# EAGLE design Caricabatterie (EAGLE 4.16)
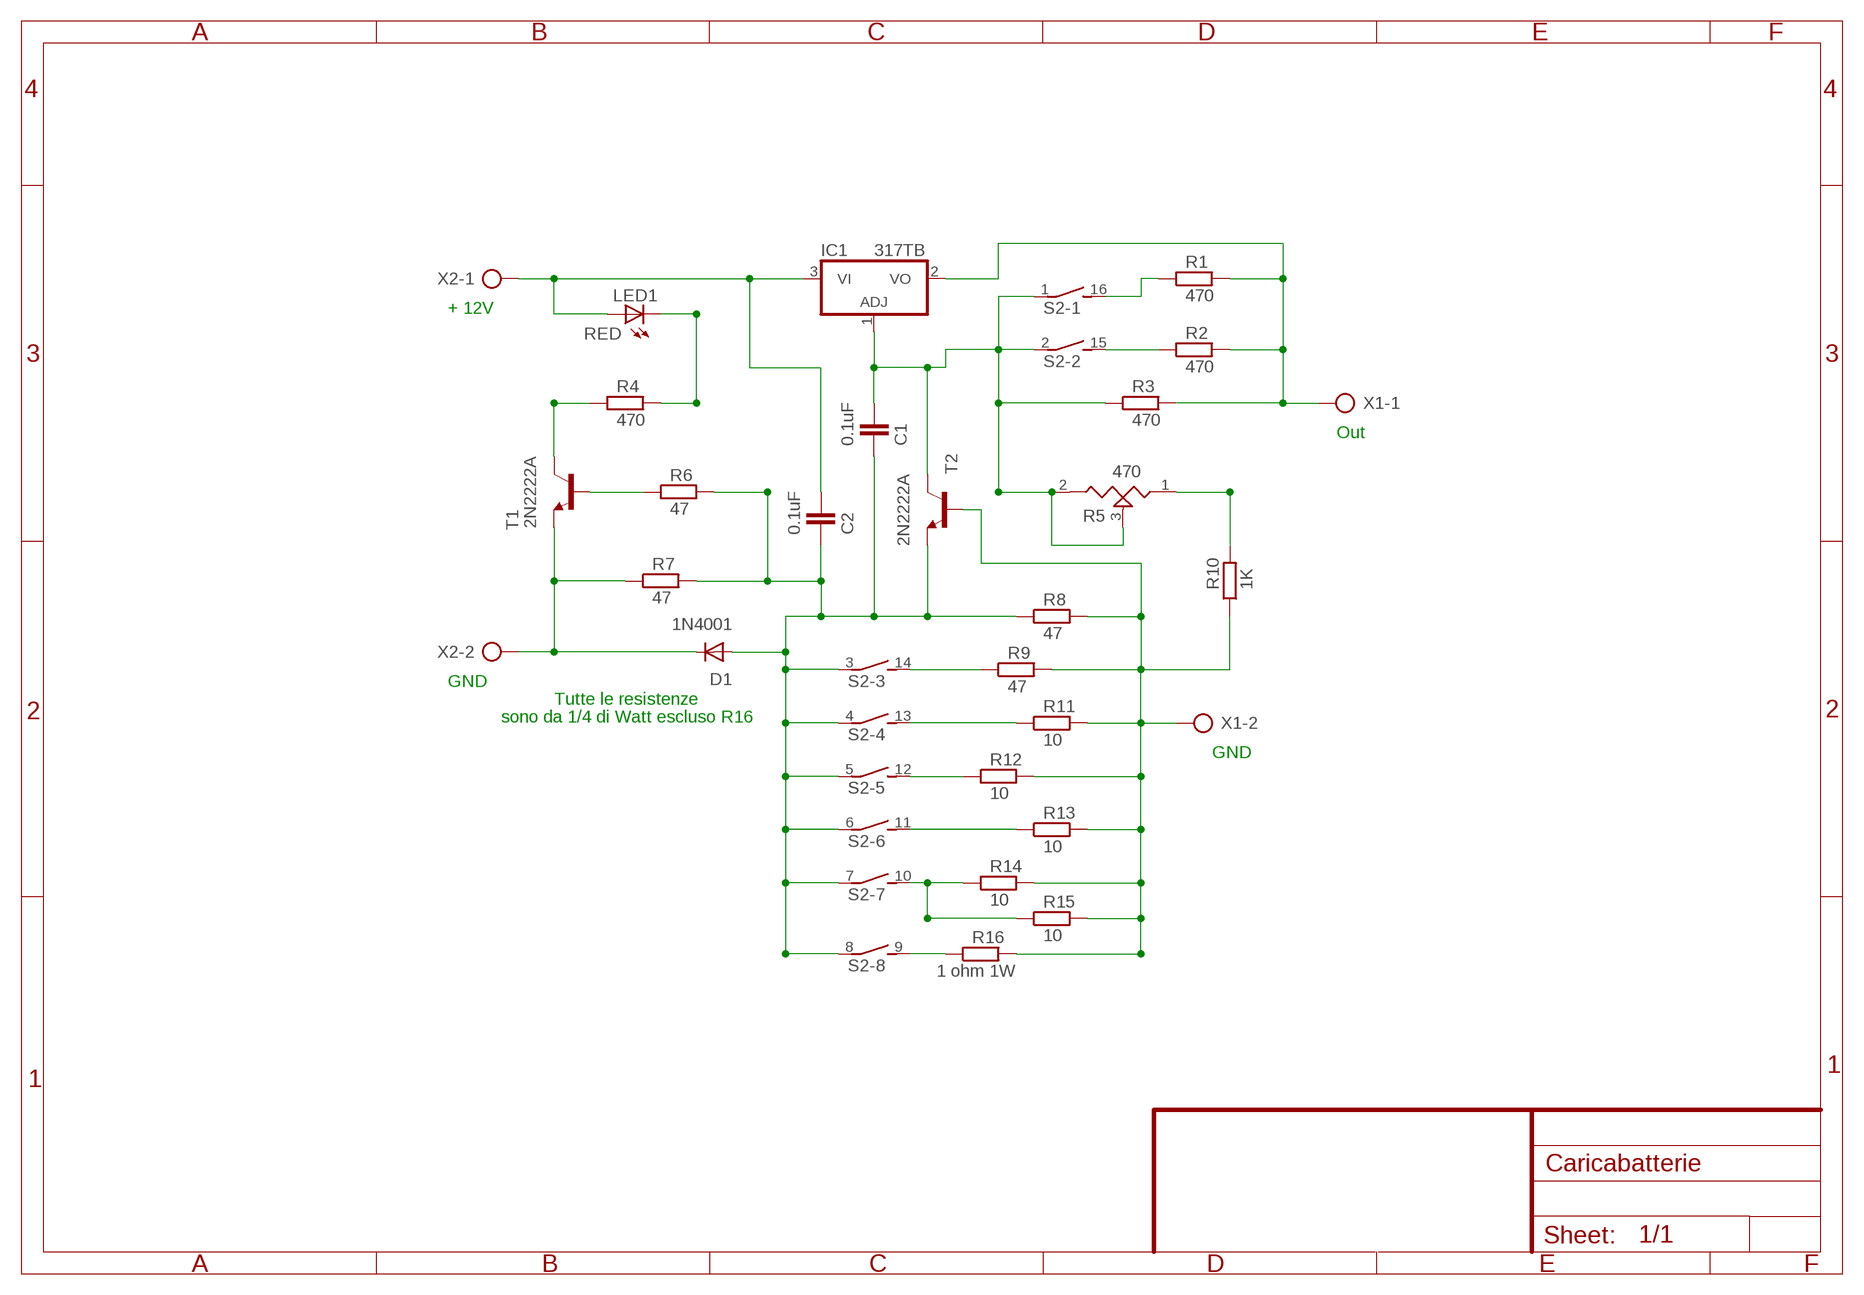
[diagram p0: schematic, sheet 1]

## Parts
C1  0.1uF  C-EU050-025X075  [C050-025X075]
C2  0.1uF  C-EU050-025X075  [C050-025X075]
D1  1N4001  1N4004  [DO41-10]
IC1  317TB  317T  [TO220H]
LED1  RED  LED5MM  [LED5MM]
R1  470  R-EU_0207/10  [0207/10]
R2  470  R-EU_0207/10  [0207/10]
R3  470  R-EU_0207/10  [0207/10]
R4  470  R-EU_0207/10  [0207/10]
R5  470  POTUS-L  [PT-10]
R6  47  R-EU_0207/10  [0207/10]
R7  47  R-EU_0207/10  [0207/10]
R8  47  R-EU_0207/10  [0207/10]
R9  47  R-EU_0207/10  [0207/10]
R10  1K  R-EU_0207/10  [0207/10]
R11  10  R-EU_0207/10  [0207/10]
R12  10  R-EU_0207/10  [0207/10]
R13  10  R-EU_0207/10  [0207/10]
R14  10  R-EU_0207/10  [0207/10]
R15  10  R-EU_0207/10  [0207/10]
R16  1 ohm 1W  R-EU_0411/15  [0411/15]
S2  DS08E  [DS-08]
T1  2N2222A  2N2222  [TO18]
T2  2N2222A  2N2222  [TO18]
X1  AK300/2  [AK300/2]
X2  AK300/2  [AK300/2]

## Nets
N$1: R4.1 T1.3(C)
N$2: LED1.K(C) R4.2
N$3: IC1.2(VO) R1.2 R2.2 R3.2 X1.1
N$4: R6.1 T1.2(B)
N$5: R1.1 S2.16
N$6: C2.1 IC1.3(VI) LED1.A X2.1
N$7: R2.1 S2.15
N$8: D1.C R7.1 T1.1(E) X2.2
N$9: C1.2 C2.2 D1.A R6.2 R7.2 R8.1 S2.3 S2.4 S2.5 S2.6 S2.7 S2.8 T2.1(E)
N$10: R5.1 R10.2
N$11: C1.1 IC1.1(ADJ) R3.1 R5.2 R5.3 S2.1 S2.2 T2.3(C)
N$12: R9.1 S2.14
N$13: R8.2 R9.2 R10.1 R11.2 R12.2 R13.2 R14.2 R15.2 R16.2 T2.2(B) X1.2
N$14: R16.1 S2.9
N$15: R14.1 R15.1 S2.10
N$16: R13.1 S2.11
N$17: R12.1 S2.12
N$18: R11.1 S2.13

## Notes on the sheet
- + 12V
- Out
- GND
- Tutte le resistenze
- sono da 1/4 di Watt escluso R16
- GND

## Library data of the parts
C1 C2 = rcl:C-EU: CAPACITOR, European symbol
D1 = diode:1N4004: DIODE general purpose rectifier, 1 A
IC1 = linear:*317: Positive VOLTAGE REGULATOR
LED1 = led:LED: LED OSRAM: - CHIPLED LG R971, LG N971, LY N971, LG Q971, LY Q971, LO R971, LY R971 LH N974, LH R974 LS Q976, LO Q976, LY Q976 LO Q996 - Hyper CHIPLED LW Q18S LB Q993, LB Q99A, LB R99A - SideLED LS A670, LO A670, LY A670, LG A670, LP A670 LB A673, LV A673, LT A673, LW A673 LH A674 LY A675 LS A676, LA A676, LO A676, LY A676, LW A676 LS A679, LY A679, LG A679 - Hyper Micro SIDELED® LS Y876, LA Y876, LO Y876, LY Y876 LT Y87S - SmartLED LW L88C, LW L88S LB L89C, LB L89S, LG L890 LS L89K, LO L89K, LY L89K LS L896, LA L896, LO L896, LY L896 - TOPLED LS T670, LO T670, LY T670, LG T670, LP T670 LSG T670, LSP T670, LSY T670, LOP T670, LYG T670 LG T671, LOG T671, LSG T671 LB T673, LV T673, LT T673, LW T673 LH T674 LS T676, LA T676, LO T676, LY T676, LB T676, LH T676, LSB T676, LW T676 LB T67C, LV T67C, LT T67C, LS T67K, LO T67K, LY T67K, LW E67C LS E67B, LA E67B, LO E67B, LY E67B, LB E67C, LV E67C, LT E67C LW T67C LS T679, LY T679, LG T679 LS T770, LO T770, LY T770, LG T770, LP T770 LB T773, LV T773, LT T773, LW T773 LH T774 LS E675, LA E675, LY E675, LS T675 LS T776, LA T776, LO T776, LY T776, LB T776 LHGB T686 LT T68C, LB T68C - Hyper Mini TOPLED® LB M676 - Mini TOPLED Santana® LG M470 LS M47K, LO M47K, LY M47K Source: http://www.osram.convergy.de/
R1-R4 R6-R16 = rcl:R-EU_: RESISTOR, European symbol
R5 = discrete:POTUS-L
S2 = switch-dil:DS08E: DIL/CODE SWITCH
T1 T2 = transistor:2N2222: NPN TRANSISTOR
X1 X2 = con-ptr500:AK300/2: CONNECTOR

## Board
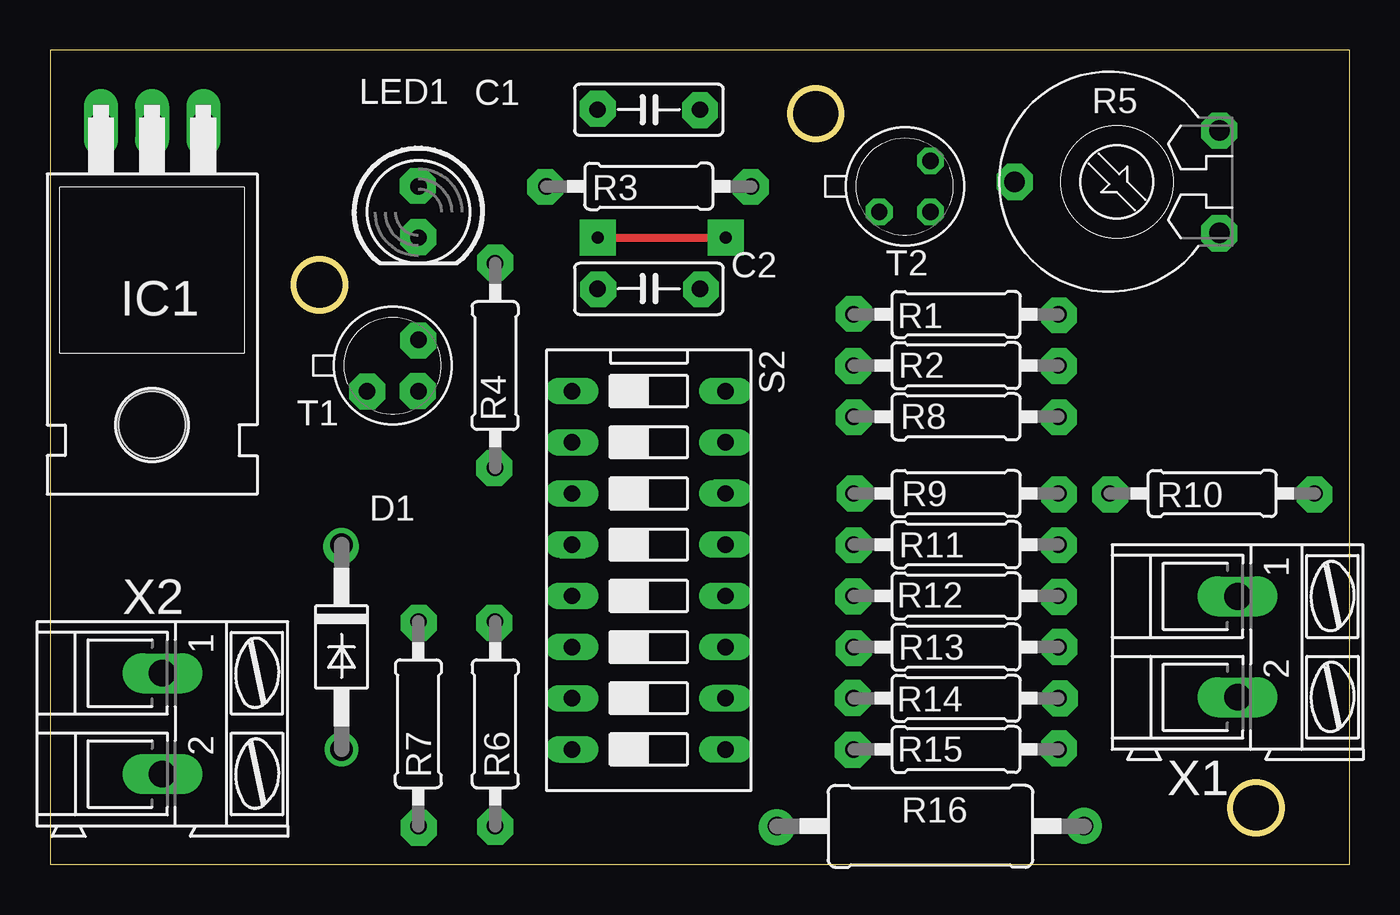
[diagram p1: board, top side]
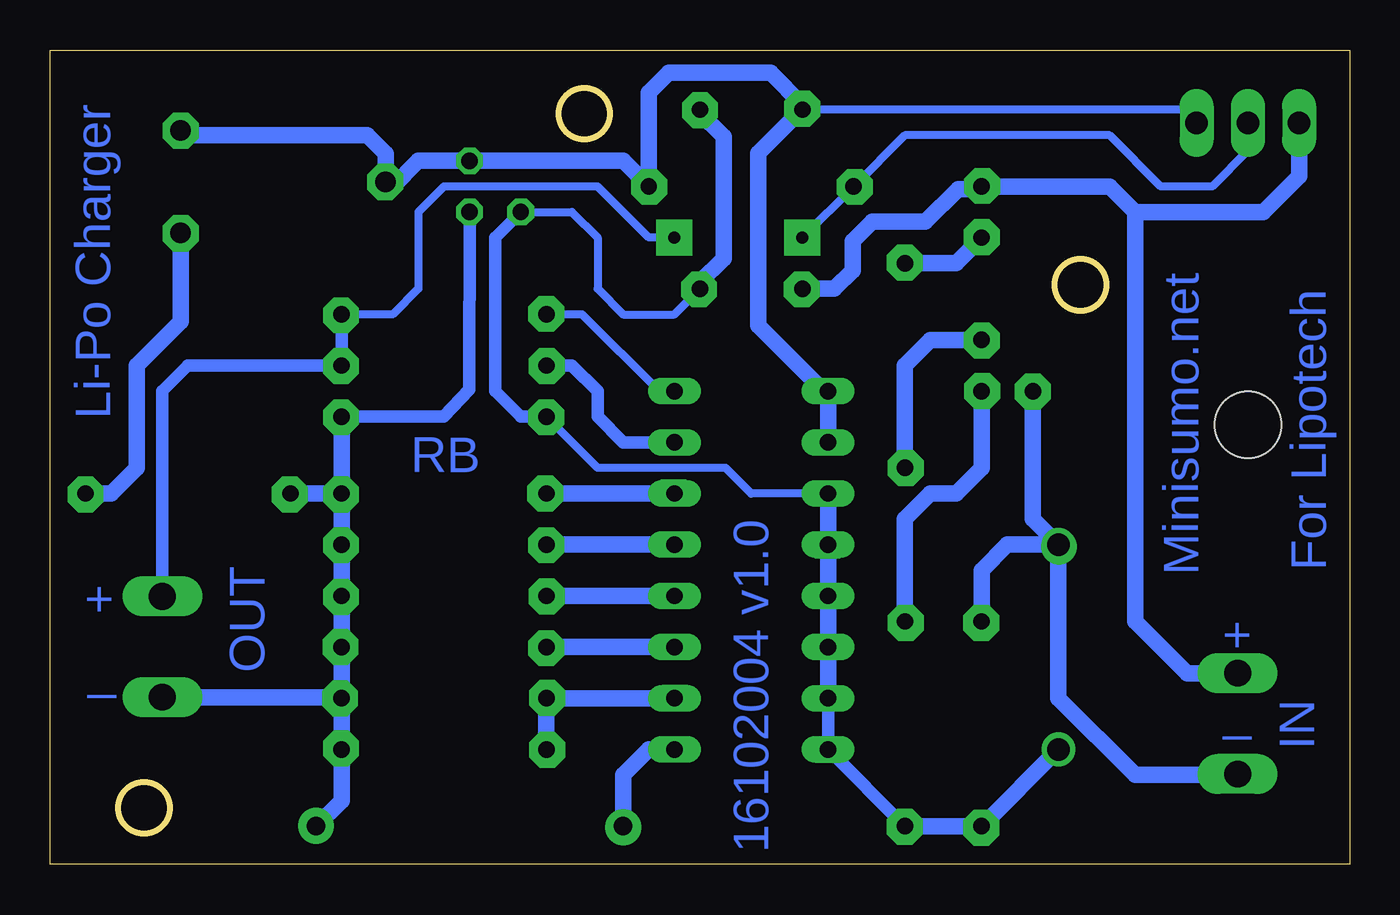
[diagram p2: board, bottom side, seen from below]

Size 64.44 x 40.4 mm. Coordinates in mm from the lower left corner, seen from the top.
Outline: 0,0 64.44,0 64.44,40.4 0,40.4 0,0
Outline: circle at 59.8,2.81 radius 1.27
Outline: circle at 13.35,28.77 radius 1.27
Outline: circle at 37.96,37.26 radius 1.27
Copper layers (1*16): Top 0.035mm / dielectric 1.5mm / Bottom 0.03mm
Design rules "default": minimum track width 10mil, minimum drill 0.0005mm, track to track 8mil, track to pad 8mil, pad to pad 8mil, via to via 8mil, smd to smd 8mil, copper to edge 40mil, drill to drill 8mil, minimum pad ring 10mil, minimum via ring 8mil, stop-mask expansion 4mil, vias tented up to drill 0mil, thermal gap 10mil

### Footprints (pad centres in the part's own frame; a part is rotated, then mirrored left to right if it is on the bottom)
C050-025X075 = drill 0.813 octagon: 1 -2.54,0; 2 2.54,0
DO41-10 = drill 1.118 round: A 5.08,0; C -5.08,0
TO220H = drill 1.118 long: 1 -2.54,-10.16; 2 0,-10.16; 3 2.54,-10.16 | hole 3.302: 0,4.826
LED5MM = drill 0.813 octagon: A -1.27,0; K 1.27,0
0207/10 = drill 0.813 octagon: 1 -5.08,0; 2 5.08,0
PT-10 = drill 1.016 pad 1.778 octagon: 1 -2.54,-5.08; 2 2.54,-5.08; 3 0,5.08
0411/15 = drill 0.914 octagon: 1 -7.62,0; 2 7.62,0
DS-08 = drill 0.813 long: 1 -8.89,-3.81; 2 -6.35,-3.81; 3 -3.81,-3.81; 4 -1.27,-3.81; 5 1.27,-3.81; 6 3.81,-3.81; 7 6.35,-3.81; 8 8.89,-3.81; 9 8.89,3.81; 10 6.35,3.81; 11 3.81,3.81; 12 1.27,3.81; 13 -1.27,3.81; 14 -3.81,3.81; 15 -6.35,3.81; 16 -8.89,3.81
TO18 = drill 0.813 octagon: 1 -1.27,-1.27; 2 1.27,-1.27; 3 1.27,1.27
AK300/2 = drill 1.321 long: 1 -2.515,0; 2 2.489,0

### Placement (x,y rotation side)
C1  29.68,37.46 0 top
C2  29.68,28.57 0 top
D1  14.44,10.79 270 top
IC1  5.04,26.64 180 top
LED1  18.25,32.38 270 top
R1  44.92,27.3 0 top
R2  44.92,24.76 0 top
R3  29.68,33.65 180 top
R4  22.06,24.76 90 top
R5  52.9,33.88 90 top
R6  22.06,6.98 270 top
R7  18.25,6.98 270 top
R8  44.92,22.22 0 top
R9  44.92,18.41 0 top
R10  57.62,18.41 0 top
R11  44.92,15.87 0 top
R12  44.92,13.33 0 top
R13  44.92,10.79 0 top
R14  44.92,8.25 0 top
R15  44.92,5.71 0 top
R16  43.65,1.9 0 top
S2  29.68,14.6 270 top
T1  16.98,24.76 0 top
T2  42.38,33.65 0 top
X1  58.89,10.79 270 top
X2  5.55,6.98 270 top

### Tracks (layer width: path | path; a pad name or v marks a point on that pad's centre or on a via)
N$1
  Bottom 0.813: R4.1 22.06,24.76 20.79,26.03 T1.3
N$2
  Bottom 0.813: R4.2 19.52,29.84 LED1.K
N$3  (via drill 0.6 pad 1.78)
  Top 0.406: v27.14,31.11 v33.49,31.11
  Bottom 0.406: v33.49,31.11 34.76,31.11 37.3,33.65 44.92,33.65 46.19,32.38 46.19,28.57 47.46,27.3 R1.2 | v27.14,31.11 R3.2 22.06,36.19 11.9,36.19 9.36,33.65 6.82,33.65 5.04,35.43 IC1.2
  Bottom 0.61: X1.1 58.89,23.49 57.62,24.76 R2.2 R1.2
N$4
  Bottom 0.813: R6.1 22.06,17.14 20.79,18.41 19.52,18.41 18.25,19.68 T1.2
N$5
  Bottom 0.406: S2.16 34.25,23.49 38.06,27.3 R1.1 39.87,27.32
N$6
  Bottom 0.813: 10.63,32.38 11.9,33.65 LED1.A 18.25,33.67 | 10.63,32.38 4.28,32.38 2.5,34.16 IC1.3 | X2.1 8.06,9.5 10.63,12.06 10.63,32.38 | C2.1 25.56,28.57 24.65,29.48 24.65,30.93 23.69,31.9 21.04,31.9 19.42,33.52 18.4,33.52 18.25,33.67 | 18.22,33.7 18.25,33.67
N$7
  Bottom 0.61: R2.1 38.57,24.76 37.3,23.49 37.3,22.22 36.03,20.95 S2.15
N$8  (via drill 0.5 pad 1.78)
  Bottom 0.406: v15.71,23.46 T1.1 | 5.55,4.44 X2.2
  Bottom 0.813: R7.1 18.25,14.6 16.98,15.87 D1.C | v15.71,23.46 15.71,17.14 D1.C | D1.C 14.44,8.25 10.63,4.44 5.55,4.44
N$9  (via drill 0.5 pad 1.78)
  Bottom 0.406: S2.3 29.68,18.41 30.95,19.68 37.3,19.68 R8.1 | T2.1 38.57,32.38 37.3,31.11 37.3,28.57 36.03,27.3 33.49,27.3 C2.2 | v32.22,37.44 C1.2
  Bottom 0.61: R8.1 41.11,22.22 42.38,23.49 42.38,31.11 T2.1 | S2.7 S2.8 R6.2
  Bottom 0.813: S2.7 S2.6 S2.5 S2.4 S2.3 | R6.2 R7.2 D1.A | C2.2 32.22,28.9 31.05,30.07 31.05,36.11 32.25,37.31 32.22,37.33 v32.22,37.44
N$10  (via drill 0.5 pad 1.78)
  Bottom 0.406: R5.1 v57.98,31.31
  Bottom 0.813: v57.98,31.31 57.98,26.94 60.16,24.76 60.16,19.68 61.43,18.41 R10.2
N$11  (via drill 0.5 pad 1.27)
  Bottom 0.406: v43.62,34.92 T2.3 | IC1.1 7.58,36.95 8.09,37.46 C1.1 | 47.46,33.65 47.69,33.88 R5.3 | 57.62,36.19 57.85,36.42 R5.2
  Bottom 0.813: S2.2 S2.1 26.07,23.49 29.32,26.74 29.32,35.3 27.16,37.46 C1.1 27.14,37.71 28.71,39.29 33.77,39.29 34.76,38.3 R3.1 36.03,34.92 v43.62,34.92 | T2.3 46.19,34.92 47.46,33.65 | R5.3 47.82,35.28 48.73,36.19 57.62,36.19
N$12
  Bottom 0.813: R9.1 S2.14
N$13
  Bottom 0.406: R14.2 50.05,8.3
  Bottom 0.61: R8.2 44.92,22.22 43.68,23.57 T2.2
  Bottom 0.813: R16.2 50,3.17 R15.2 R14.2 R13.2 R12.2 R11.2 R9.2 | 50.05,8.3 X1.2 | R9.2 R8.2 | R10.1 R9.2
N$14  (via drill 0.5 pad 1.27)
  Bottom 0.406: S2.9 v33.52,5.71
  Bottom 0.61: v33.52,5.71 34.76,5.71
  Bottom 0.813: 34.76,5.71 36.03,4.44 R16.1
N$15
  Bottom 0.813: R15.1 R14.1 S2.10
N$16
  Bottom 0.813: R13.1 S2.11
N$17
  Bottom 0.813: R12.1 S2.12
N$18
  Bottom 0.813: R11.1 S2.13
N$21  (via drill 0.5 pad 1.42)
  other vias: 7.56,36.9
N$23  (via drill 0.5 pad 1.42)
  other vias: 5.02,36.8
N$24  (via drill 0.5 pad 1.42)
  other vias: 2.48,36.85
N$25  (via drill 0.5 pad 1.27, 0.5 pad 1.78)
  other vias: 50.03,18.36 50.03,15.82
N$26  (via drill 0.5 pad 1.78)
  other vias: 50.03,15.84
N$27  (via drill 0.5 pad 1.78)
  other vias: 50.03,22.19
N$28  (via drill 0.5 pad 1.78)
  other vias: 50.03,24.73
N$29  (via drill 0.5 pad 1.78)
  other vias: 50.03,27.25
N$31  (via drill 0.5 pad 1.78)
  other vias: 39.81,24.73 39.84,27.33
N$32  (via drill 0.5 pad 1.78)
  other vias: 39.84,22.19
N$33  (via drill 0.5 pad 1.78)
  other vias: 39.89,18.41
N$34  (via drill 0.5 pad 1.78)
  other vias: 39.84,15.84
N$35  (via drill 0.5 pad 1.78)
  other vias: 39.81,13.3
N$36  (via drill 0.5 pad 1.78)
  other vias: 39.84,10.74
N$37  (via drill 0.5 pad 1.78)
  other vias: 39.79,8.28
N$38  (via drill 0.5 pad 1.78)
  other vias: 39.79,5.68
N$39  (via drill 0.5 pad 1.78)
  other vias: 62.7,18.36
N$40  (via drill 0.5 pad 1.78)
  other vias: 52.57,18.36
N$41  (via drill 0.5 pad 1.27)
  other vias: 33.46,8.28
N$42  (via drill 0.5 pad 1.27)
  other vias: 33.39,10.82
N$43  (via drill 0.5 pad 1.27)
  other vias: 33.46,13.33
N$44  (via drill 0.5 pad 1.27)
  other vias: 25.84,13.33
N$45  (via drill 0.5 pad 1.27)
  other vias: 25.9,10.79
N$46  (via drill 0.5 pad 1.27)
  other vias: 25.84,8.25
N$47  (via drill 0.5 pad 1.27)
  other vias: 25.87,5.68
N$48  (via drill 0.5 pad 1.27)
  other vias: 25.9,15.82
N$49  (via drill 0.5 pad 1.27)
  other vias: 33.44,15.9
N$50  (via drill 0.5 pad 1.27)
  other vias: 25.84,18.41
N$51  (via drill 0.5 pad 1.27)
  other vias: 25.84,20.95
N$52  (via drill 0.5 pad 1.27)
  other vias: 25.92,23.52
N$54  (via drill 0.5 pad 1.27)
  other vias: 33.36,20.95 33.49,23.49
N$55  (via drill 0.5 pad 1.27)
  other vias: 33.54,18.46
N$56  (via drill 0.5 pad 1.78)
  other vias: 22.01,19.68
N$57  (via drill 0.5 pad 1.78)
  other vias: 22.01,11.98
N$58  (via drill 0.5 pad 1.78)
  other vias: 18.28,11.98
N$59  (via drill 0.5 pad 1.78)
  other vias: 22.06,1.87
N$60  (via drill 0.5 pad 1.78)
  other vias: 18.28,1.82
N$61  (via drill 0.5 pad 1.27)
  other vias: 14.41,5.71
N$62  (via drill 0.5 pad 1.78)
  other vias: 14.41,15.77
N$63  (via drill 0.5 pad 1.68)
  other vias: 5.63,4.47
N$64  (via drill 0.5 pad 1.68)
  other vias: 5.65,9.55
N$65  (via drill 0.5 pad 1.78)
  other vias: 18.22,23.49
N$66  (via drill 0.5 pad 1.78)
  other vias: 18.25,26
N$67  (via drill 0.5 pad 1.78)
  other vias: 27.17,28.54
N$68  (via drill 0.5 pad 1.78)
  other vias: 22.06,29.87
N$69  (via drill 0.5 pad 1.78)
  other vias: 18.25,31.14
N$70  (via drill 0.5 pad 1.78)
  other vias: 18.22,33.68
N$72  (via drill 0.5 pad 1.78)
  other vias: 34.73,33.62
N$73  (via drill 0.5 pad 1.78)
  other vias: 27.14,37.51
N$74  (via drill 0.5 pad 1.78)
  other vias: 32.27,28.54
N$75  (via drill 0.5 pad 1.78)
  other vias: 24.55,33.62
N$76  (via drill 0.5 pad 1.27)
  other vias: 41.08,32.41
N$77  (via drill 0.5 pad 1.27)
  other vias: 43.62,32.38
N$80  (via drill 0.5 pad 1.68)
  other vias: 58.86,13.25
N$81  (via drill 0.5 pad 1.68)
  other vias: 59.04,8.25
N$82  (via drill 0.5 pad 1.78)
  other vias: 50.03,13.28
N$83  (via drill 0.5 pad 1.78)
  other vias: 50.05,10.79
N$84  (via drill 0.5 pad 1.78)
  other vias: 50.08,8.25
N$85  (via drill 0.5 pad 1.78)
  other vias: 50.03,5.76
N$86  (via drill 0.5 pad 1.78)
  other vias: 36.03,1.85
N$87  (via drill 0.5 pad 1.78)
  other vias: 51.27,1.93
N$88  (via drill 0.5 pad 1.78)
  other vias: 47.84,33.85
N$89  (via drill 0.5 pad 1.42)
  other vias: 57.98,36.37

### Text on the board
Bottom: Li-Po Charger | RB | For Lipotech | Minisumo.net | + | + | OUT | _ | _ | IN | 16102004 v1.0